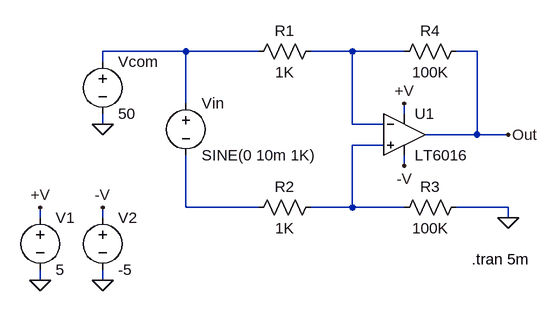
[diagram p0: schematic 6016.asc]
6016.asc, the LTspice schematic file:
Version 4
SHEET 1 880 680
WIRE 80 64 -48 64
WIRE 192 64 80 64
WIRE 336 64 272 64
WIRE 416 64 336 64
WIRE 528 64 496 64
WIRE -48 80 -48 64
WIRE 80 144 80 64
WIRE 416 160 416 144
WIRE -48 176 -48 160
WIRE 336 176 336 64
WIRE 384 176 336 176
WIRE 528 192 528 64
WIRE 528 192 448 192
WIRE 576 192 528 192
WIRE 384 208 336 208
WIRE 416 240 416 224
WIRE 80 304 80 224
WIRE 192 304 80 304
WIRE 336 304 336 208
WIRE 336 304 272 304
WIRE 416 304 336 304
WIRE 576 304 496 304
WIRE -144 320 -144 304
WIRE -48 320 -48 304
WIRE 576 320 576 304
WIRE -144 416 -144 400
WIRE -48 416 -48 400
FLAG -144 416 0
FLAG -48 416 0
FLAG -144 304 +V
FLAG 416 240 -V
FLAG -48 176 0
FLAG 576 320 0
FLAG 576 192 Out
FLAG 416 144 +V
FLAG -48 304 -V
SYMBOL LT6016 416 192 R0
SYMATTR InstName U1
SYMBOL voltage -144 304 R0
SYMATTR InstName V1
SYMATTR Value 5
SYMBOL voltage -48 304 R0
SYMATTR InstName V2
SYMATTR Value -5
SYMBOL voltage -48 64 R0
SYMATTR InstName Vcom
SYMATTR Value 50
SYMBOL res 288 48 R90
WINDOW 0 0 56 VBottom 2
WINDOW 3 32 56 VTop 2
SYMATTR InstName R1
SYMATTR Value 1K
SYMBOL res 288 288 R90
WINDOW 0 0 56 VBottom 2
WINDOW 3 32 56 VTop 2
SYMATTR InstName R2
SYMATTR Value 1K
SYMBOL voltage 80 128 R0
SYMATTR InstName Vin
SYMATTR Value SINE(0 10m 1K)
SYMBOL res 512 288 R90
WINDOW 0 0 56 VBottom 2
WINDOW 3 32 56 VTop 2
SYMATTR InstName R3
SYMATTR Value 100K
SYMBOL res 512 48 R90
WINDOW 0 0 56 VBottom 2
WINDOW 3 32 56 VTop 2
SYMATTR InstName R4
SYMATTR Value 100K
TEXT 520 384 Left 2 !.tran 5m

The netlist it stands for:
* 6016.asc
* U1: LT6016 (symbol LT6016 not available, pins judged from their places): In+=N003 In-=N002 V+=+V V-=-V OUT=Out
V1 +V 0 5
V2 -V 0 -5
Vcom N001 0 50
R1 N002 N001 1K
R2 N003 N004 1K
Vin N001 N004 SINE(0 10m 1K)
R3 0 N003 100K
R4 Out N002 100K
.tran 5m
.backanno
.end